# Altium schematic sheet MCU_STM32F407VGT6.SchDoc: STM32F446 CNC
size B; Author: AM; CompanyName: Expatria Technologies; DrawnBy: A.Marles; Engineer: AM; Organization: Expatria Technologies; DocumentNumber: 3; SheetNumber: 3; SheetTotal: 14
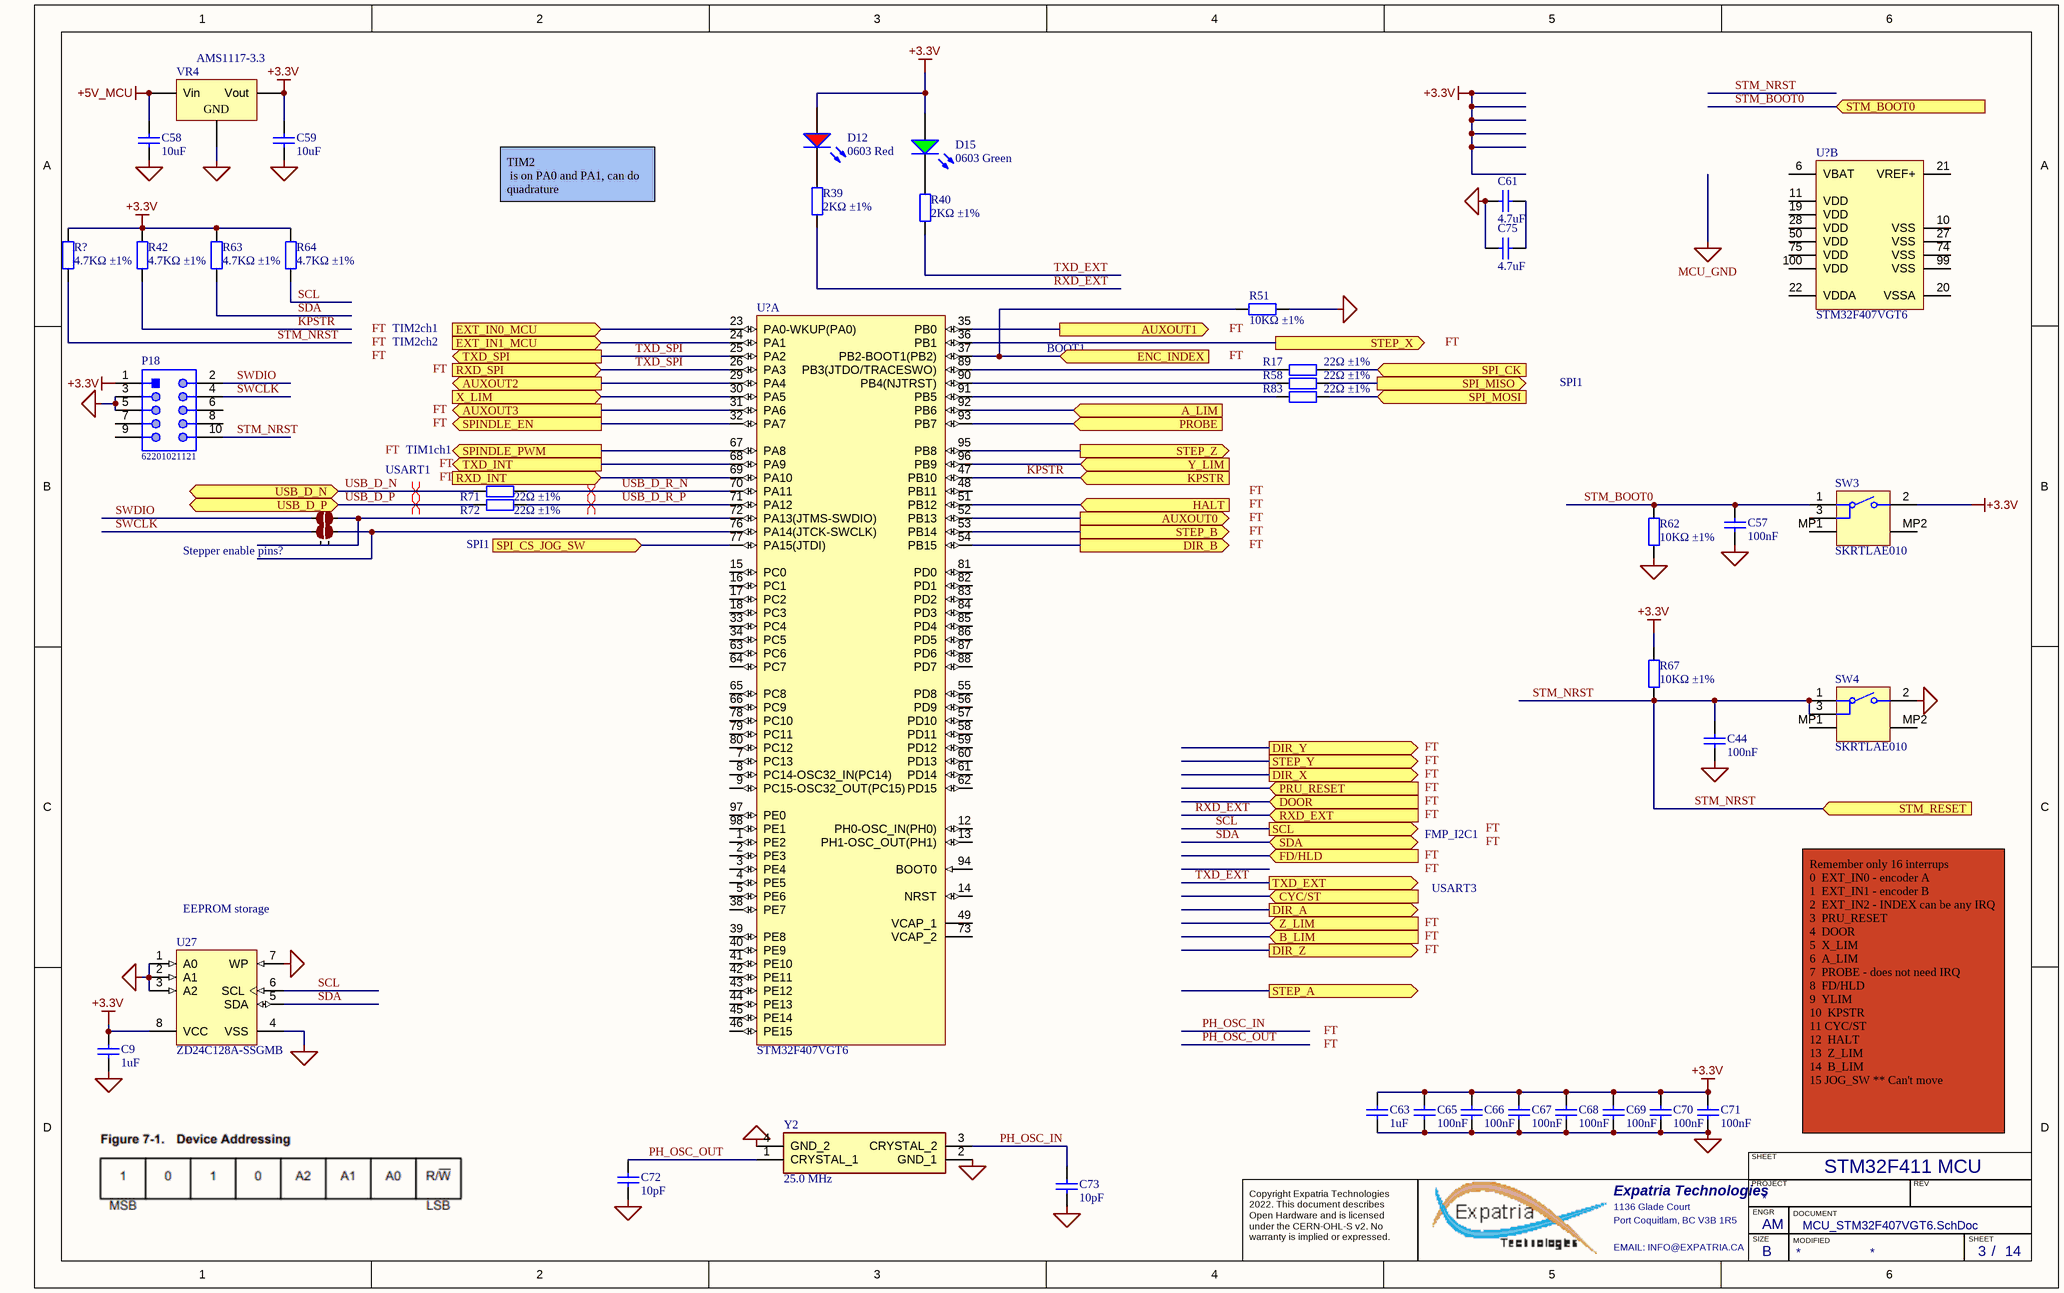
[diagram p0: MCU_STM32F407VGT6.SchDoc]

## Parts
(Parts that share a designator on the sheet are numbered #1, #2 ... from top to bottom, then left to right.)
C9  1uF  [0603_C]
C44  100nF  [0603_C]
C57  100nF  [0603_C]
C58  10uF  [1206_C]
C59  10uF  [1206_C]
C61  4.7uF  [0603_C]
C63  1uF  [0603_C]
C65  100nF  [0603_C]
C66  100nF  [0603_C]
C67  100nF  [0603_C]
C68  100nF  [0603_C]
C69  100nF  [0603_C]
C70  100nF  [0603_C]
C71  100nF  [0603_C]
C72  10pF  [0603_C]
C73  10pF  [0603_C]
C75  4.7uF  [0603_C]
D12  0603 Red  [0603_LED_S1]
D15  0603 Green  [0603_LED_S1]
J10  2 way net solder junction - Normally Open  [2waySolder_NO]  (value not drawn)  (no BOM)
J11  2 way net solder junction - Normally Open  [2waySolder_NO]  (value not drawn)  (no BOM)
P18  62201021121  [62201021121]  (no BOM)
R17  22Ω ±1%  [0603_R]
R39  2KΩ ±1%  [0603_R]
R40  2KΩ ±1%  [0603_R]
R42  4.7KΩ ±1%  [0603_R]
R51  10KΩ ±1%  [0603_R]
R58  22Ω ±1%  [0603_R]
R62  10KΩ ±1%  [0603_R]
R63  4.7KΩ ±1%  [0603_R]
R64  4.7KΩ ±1%  [0603_R]
R67  10KΩ ±1%  [0603_R]
R71  22Ω ±1%  [0603_R]
R72  22Ω ±1%  [0603_R]
R83  22Ω ±1%  [0603_R]
R?  4.7KΩ ±1%  [0603_R]
SW3  SKRTLAE010  [ALPS-SKRTLAE010_V]
SW4  SKRTLAE010  [ALPS-SKRTLAE010_V]
U27  ZD24C128A-SSGMB  [SOIC-SN8_L]
U?#1  STM32F407VGT6  [STM-LQFP100_M]  (part B of 2)
U?#2  STM32F407VGT6  [STM-LQFP100_M]  (part A of 2)
VR4  AMS1117-3.3  [SOT-223]
Y2  25.0 MHz  [YSX321SL]

## Ports
A_LIM (in), AUXOUT0 (out), AUXOUT1 (out), AUXOUT2 (out), AUXOUT3 (out), B_LIM (in), CYC/ST (in), DIR_A (out), DIR_B (out), DIR_X (out), DIR_Y (out), DIR_Z (out), DOOR (in), ENC_INDEX (in), EXT_IN0_MCU (in), EXT_IN1_MCU (in), FD/HLD (in), HALT (in), KPSTR (in), PROBE (in), PRU_RESET (in), RXD_EXT (in), RXD_INT (in), RXD_SPI (in), SCL (out), SDA (bidir), SPI_CK (in), SPI_CS_JOG_SW (in), SPI_MISO (out), SPI_MOSI (in), SPINDLE_EN (out), SPINDLE_PWM (out), STEP_A (out), STEP_B (out), STEP_X (out), STEP_Y (out), STEP_Z (out), STM_BOOT0 (in), STM_RESET (in), TXD_EXT (out), TXD_INT (out), TXD_SPI (out), USB_D_N (bidir), USB_D_P (bidir), X_LIM (in), Y_LIM (in), Z_LIM (in)

## Nets
+3.3V: C9.2 C59.2 C63.2 C65.2 C66.2 C67.2 C68.2 C69.2 C70.2 C71.2 D12.A D15.A P18.1 R42.2 R63.2 R64.2 R67.1 R?.2 SW3.2 U27.8(VCC) VR4.2(Vout)
+5V_MCU: C58.2 VR4.3(Vin)
MCU_GND: C9.1 C44.1 C57.1 C58.1 C59.1 C61.1 C63.1 C65.1 C66.1 C67.1 C68.1 C69.1 C70.1 C71.1 C72.1 C73.1 C75.1 P18.3 P18.5 R51.1 R62.2 SW4.2 U27.1(A0) U27.2(A1) U27.3(A2) U27.4(VSS) U27.7(WP) VR4.1(GND) Y2.2(GND_1) Y2.4(GND_2)
A_LIM: U?#2.92(PB6) ; port A_LIM
AUXOUT0: U?#2.52(PB13) ; port AUXOUT0
AUXOUT1: U?#2.35(PB0) ; port AUXOUT1
AUXOUT2: U?#2.29(PA4) ; port AUXOUT2
AUXOUT3: U?#2.31(PA6) ; port AUXOUT3
DIR_B: U?#2.54(PB15) ; port DIR_B
ENC_INDEX: R51.2 U?#2.37(PB2-BOOT1(PB2)) ; port ENC_INDEX
EXT_IN0_MCU: U?#2.23(PA0-WKUP(PA0)) ; port EXT_IN0_MCU
EXT_IN1_MCU: U?#2.24(PA1) ; port EXT_IN1_MCU
HALT: U?#2.51(PB12) ; port HALT
KPSTR: R42.1 U?#2.47(PB10) ; port KPSTR
PH_OSC_IN: C73.2 Y2.3(CRYSTAL_2)
PH_OSC_OUT: C72.2 Y2.1(CRYSTAL_1)
PROBE: U?#2.93(PB7) ; port PROBE
RXD_EXT: R39.1 ; port RXD_EXT
RXD_INT: U?#2.69(PA10) ; port RXD_INT
SCL: R64.1 U27.6(SCL) ; port SCL
SDA: R63.1 U27.5(SDA) ; port SDA
SPI_CK: R17.2 ; port SPI_CK
SPI_CS_JOG_SW: U?#2.77(PA15(JTDI)) ; port SPI_CS_JOG_SW
SPI_MISO: R58.2 ; port SPI_MISO
SPI_MOSI: R83.2 ; port SPI_MOSI
SPINDLE_EN: U?#2.32(PA7) ; port SPINDLE_EN
SPINDLE_PWM: U?#2.67(PA8) ; port SPINDLE_PWM
STEP_B: U?#2.53(PB14) ; port STEP_B
STEP_X: U?#2.36(PB1) ; port STEP_X
STEP_Z: U?#2.95(PB8) ; port STEP_Z
STM_BOOT0: C57.2 R62.1 SW3.1 ; port STM_BOOT0
STM_NRST: C44.2 P18.10 R67.2 R?.1 SW4.1 SW4.3 ; port STM_RESET
SWCLK: J11.1 P18.4
SWDIO: J10.1 P18.2
TXD_EXT: R40.1 ; port TXD_EXT
TXD_INT: U?#2.68(PA9) ; port TXD_INT
TXD_SPI: U?#2.25(PA2) U?#2.26(PA3) ; port TXD_SPI, port RXD_SPI
USB_D_N: R71.2 ; port USB_D_N
USB_D_P: R72.2 ; port USB_D_P
USB_D_R_N: R71.1 U?#2.70(PA11)
USB_D_R_P: R72.1 U?#2.71(PA12)
X_LIM: U?#2.30(PA5) ; port X_LIM
Y_LIM: U?#2.96(PB9) ; port Y_LIM
NetC61_2: C61.2 C75.2
NetD12_K: D12.K R39.2
NetD15_K: D15.K R40.2
NetJ10_2: J10.2 U?#2.72(PA13(JTMS-SWDIO))
NetJ11_2: J11.2 U?#2.76(PA14(JTCK-SWCLK))
NetR17_1: R17.1 U?#2.89(PB3(JTDO/TRACESWO))
NetR58_1: R58.1 U?#2.90(PB4(NJTRST))
NetR83_1: R83.1 U?#2.91(PB5)

Not connected (* = marked no-connect by the designer): P18 6 7 8 9; SW3 3 MP1 MP2; SW4 MP1 MP2; U?#1 6(VBAT) 10(VSS) 11(VDD) 19(VDD) 20(VSSA) 21(VREF+) 22(VDDA) 27(VSS) 28(VDD) 50(VDD) 74(VSS) 75(VDD) 99(VSS) 100(VDD); U?#2 1(PE2) 2(PE3) 3(PE4) 4(PE5) 5(PE6) 7(PC13) 8(PC14-OSC32_IN(PC14)) 9(PC15-OSC32_OUT(PC15)) 12(PH0-OSC_IN(PH0)) 13(PH1-OSC_OUT(PH1)) 14(NRST) 15(PC0) 16(PC1) 17(PC2) 18(PC3) 33(PC4) 34(PC5) 38(PE7) 39(PE8) 40(PE9) 41(PE10) 42(PE11) 43(PE12) 44(PE13) 45(PE14) 46(PE15) 48(PB11) 49(VCAP_1) 55(PD8) 56(PD9) 57(PD10) 58(PD11) 59(PD12) 60(PD13) 61(PD14) 62(PD15) 63(PC6) 64(PC7) 65(PC8) 66(PC9) 73(VCAP_2) 78(PC10) 79(PC11) 80(PC12) 81(PD0) 82(PD1) 83(PD2) 84(PD3) 85(PD4) 86(PD5) 87(PD6) 88(PD7) 94(BOOT0) 97(PE0) 98(PE1)

## Layout directives
differential pair: USB_D_N, USB_D_P, USB_D_R_N, USB_D_R_P

## Notes on the sheet
- TIM2
  is on PA0 and PA1, can do quadrature
- FT
- TIM2ch1
- TIM2ch2
- BOOT1
- (near R51) FT
- SPI1
- USART1
- TIM1ch1
- Stepper enable pins?
- FMP_I2C1
- (near U27) EEPROM storage
- USART3
- Remember only 16 interrups
  0  EXT_IN0 - encoder A
  1  EXT_IN1 - encoder B
  2  EXT_IN2 - INDEX can be any IRQ
  3  PRU_RESET
  4  DOOR
  5  X_LIM
  6  A_LIM
  7  PROBE - does not need IRQ
  8  FD/HLD
  9  YLIM
  10  KPSTR
  11 CYC/ST
  12  HALT
  13  Z_LIM
  14  B_LIM
  15 JOG_SW ** Can't move
- STM32F411 MCU
- SHEET
- Expatria Technologies
- 1136 Glade Court
- Port Coquitlam, BC V3B 1R5
- PROJECT
- SIZE
- ENGR
- MODIFIED
- DOCUMENT
- REV
- Copyright Expatria Technologies 2022. This document describes Open Hardware and is licensed under the CERN-OHL-S v2. No warranty is implied or expressed.
- EMAIL: INFO@EXPATRIA.CA
- B
- /

## Library data of the parts
C9 C63 = 0603 1uF (105) 10% 50V: Chip capacitors; Manufacturer: Samsung Electro-Mechanics; PartNumber: CL10A105KB8NNNC; Tolerance: 10%; Voltage: 50V; Package: 0603; Supplier: LC; SuppliersPartNumber: C15849; Capacitance: 1uF; ComponentLink1Description: Supplier link; ComponentLink1URL: http://www.szlcsc.com/product/details_16531.html
C44 C57 C65-C71 = 0603 100nF (104) 10% 50V: Chip capacitors; Manufacturer: YAGEO; PartNumber: CC0603KRX7R9BB104; Tolerance: 10%; Voltage: 50V; ComponentLink1Description: Supplier link; ComponentLink1URL: http://www.szlcsc.com/product/details_15331.html; Package: 0603; Supplier: LC; SuppliersPartNumber: C14663; Capacitance: 100nF
C58 C59 = 1206 10uF (106) 10% 50V: Chip capacitors; Manufacturer: Samsung Electro-Mechanics; PartNumber: CL31A106KBHNNNE; Tolerance: 10%; Voltage: 50V; ComponentLink1Description: Supplier link; ComponentLink1URL: http://www.szlcsc.com/product/details_14236.html; Package: 1206; Supplier: LC; SuppliersPartNumber: C13585; Capacitance: 10uF; Manufacturer 1: Samsung Electro-Mechanics
C61 C75 = 0603 4.7uF (475) 10% 16V: Chip capacitors; Manufacturer: Samsung Electro-Mechanics; PartNumber: CL10A475KO8NNNC; Tolerance: 10%; Voltage: 16V; ComponentLink1Description: Supplier link; ComponentLink1URL: http://www.szlcsc.com/product/details_20375.html; Package: 0603; Supplier: LC; SuppliersPartNumber: C19666; Capacitance: 4.7uF
C72 C73 = 0603 10pF (100) 5% 50V: Chip capacitors; Manufacturer: Samsung Electro-Mechanics; PartNumber: CL10C100JB8NNNC; Tolerance: 5%; Voltage: 50V; ComponentLink1Description: Supplier link; ComponentLink1URL: http://www.szlcsc.com/product/details_1986.html; Package: 0603; Supplier: LC; SuppliersPartNumber: C1634; Capacitance: 10pF
D12 = 0603 LED Red: LED; ComponentLink1Description: 供应商链接; ComponentLink1URL: http://www.szlcsc.com/product/details_2659.html; Package: 0603; Supplier: LC; SuppliersPartNumber: C2286; Color: Red
D15 = 0603 LED Green: LED; ComponentLink1Description: 供应商链接; ComponentLink1URL: http://www.szlcsc.com/product/details_73152.html; Package: 0603; Supplier: LC; SuppliersPartNumber: C72043; Color: Green
J10 J11 = 2waySolderNO: ComponentLink1URL: http://www.edatools.cz/addons; ComponentLink1Description: Source
P18 = CMP-1502-00948-1: THT Vertical Pin Header WR-PHD, Pitch 1.27 mm, Dual Row, 10 pins; Manufacturer: Wurth Elektronik; Rated Current: 1A; Pin Number: 10; Working Voltage: 100VAC; Contact Resistance: 20mOhm; Withstanding Voltage: 500VAC; Pitch: 1.27mm; Gender: Male; Mounting Technology: THT; Manufacturer URL: http://www.we-online.de; Package Reference: 62201021121; Row Number: Dual; Datasheet URL: https://katalog.we-online.de/em/datasheet/62201021121.pdf; Publisher: WurthElektronik; Packaging: Box; Operating Temperature: -40to105degC; Orientation: Vertical; Part Number: 62201021121
R17 R58 R71 R72 R83 = 0603 22R (22R0) 1%: Chip resistor; Manufacturer: Uniroyal Elec; PartNumber: 0603WAF220JT5E; Power: 1/10W; ComponentLink1Description: Supplier link; ComponentLink1URL: http://www.szlcsc.com/product/details_24078.html; Package: 0603; Supplier: LC; SuppliersPartNumber: C23345; Resistance: 22Ω; Tolerance: 1%
R39 R40 = 0603 2K (2001) 1%: Chip resistor; Manufacturer: Uniroyal Elec; PartNumber: 0603WAF2001T5E; Power: 1/10W; ComponentLink1Description: Supplier link; ComponentLink1URL: http://www.szlcsc.com/product/details_23702.html; Package: 0603; Supplier: LC; SuppliersPartNumber: C22975; Resistance: 2KΩ; Tolerance: 1%
R42 R63 R64 R? = 0603 4.7K (4701) 1%: Chip resistor; Manufacturer: Uniroyal Elec; PartNumber: 0603WAF4701T5E; Power: 1/10W; ComponentLink1Description: Supplier link; ComponentLink1URL: http://www.szlcsc.com/product/details_23889.html; Package: 0603; Supplier: LC; SuppliersPartNumber: C23162; Resistance: 4.7KΩ; Tolerance: 1%
R51 R62 R67 = 0603 10K (1002) 1%: Chip resistor; Manufacturer: Uniroyal Elec; PartNumber: 0603WAF1002T5E; Power: 1/10W; ComponentLink1Description: Supplier link; ComponentLink1URL: http://www.szlcsc.com/product/details_26547.html; Package: 0603; Supplier: LC; SuppliersPartNumber: C25804; Resistance: 10KΩ; Tolerance: 1%
SW3 SW4 = CMP-2000-07073-2: Side Push Type, 250 V, -40 to 90 degC, 3-Pin SMD, RoHS, Tape and Reel; Manufacturer: ALPS; Operating Force: 1.6N; Folder: Unified Components\Components\New Releases\New\; Maximum Current Rating: 0.05@12VDCA; RevisionId: 1; Pole Throw Configuration: SPST; Switch Configuration: N.O.; AccessRights: 2147483647; Maximum DC Voltage Rating: 12V; ContentType: Unified Component; Rad Hard: No; Mounting: SurfaceMount; Datasheet URL: http://www.alps.com/prod/info/E/PDF/Tact/SurfaceMount/SKRT/SKRT.PDF; Manufacturer URL: http://www.alps.com/e/; ReleaseDate: 22/09/2017 06:13:25 AM; ItemHRID: CMP-2000-07073; ContentTypeGUID: CB3C11C4-E317-11DF-B822-12313F0024A2; LifeCycle: Released; ItemGUID: EAC55BEC-37DC-4BDB-8BA7-D75E6D5C3D75; Packaging: Tape&Reel; Package Reference: SKRTLAE010; FolderGUID: B7F4506A-9127-42E7-A087-46FE7B18D116; Datasheet Version: 06/2015; Mounting Technology: SurfaceMount; LifeCycleStateGUID: 61E382EE-6656-4F12-9E24-BE9327104A25; Package Description: 3-Pin Surface Mount Device, Body 4.5 x 3.55 mm, Pitch 1.225 mm; SuppliersPartNumber: C110293; Manufacturer 1: ALPS
U27 = CMP-0159-00216-1: IC EEPROM 128KBIT I2C 8SOIC; SuppliersPartNumber: C918271
U?#1 U?#2 = CMP-0243-00017-3: ARM Cortex-M4 32-bit MCU+FPU, 210 DMIPS, 1024 kB Flash, 192 kB Internal RAM, 82 I/Os, 100-pin LQFP, -40 to 85 degC, Tray; Manufacturer: STMicroelectronics; Supply Voltage(Vcc) min (V): 1.8; Supply Voltage(Vcc) max (V): 3.6; I/Os (High Current): 82; Operating Frequency(F) (Processor speed) (MHz): 168; D/A Converter: 2x12-bit; FLASH Size (Prog) (kB): 1024; Internal RAM Size (kB): 192; PackageDescription: 100-Pin Low Profile Quad Flat Package, 14 x 14 mm Body, 0.5 mm Pitch; ComponentLink3URL: http://www.st.com/st-web-ui/static/active/en/resource/technical/document/data_brief/DM00071938.pdf; PackageVersion: Rev. 1, 06/2013; PackageReference: LQFP100; PartNumber: STM32F407VGT6; ComponentLink1Description: Manufacturer URL; ComponentLink2URL: http://www.st.com/st-web-ui/static/active/en/resource/technical/document/datasheet/DM00037051.pdf; DatasheetVersion: Rev. 4; ComponentLink3Description: Package Specification; Core: ARM Cortex-M4; ComponentLink2Description: Datasheet; Mounting Technology: Surface Mount; ComponentLink1URL: http://www.st.com/web/en/home.html; Packing: Tray
VR4 = SOT-223 AMS1117-3.3: Vout=3.3V 1A 72dB@(120Hz) (LDO); Manufacturer 1: AMS; ComponentLink1Description: 供应商链接; ComponentLink1URL: http://www.szlcsc.com/product/details_6652.html; Package: SOT-223; Supplier: LC; SuppliersPartNumber: C6186; Manufacturer Part Number 1: AMS1117-3.3
Y2 = YSX321SL: Crystal or Oscillator; Manufacturer_Name: Yangxing Tech; Manufacturer_Part_Number: X322525MSB4SI; Height: 0.8mm; SuppliersPartNumber: C13740